# Altium schematic sheet Microcontroller.SchDoc: Стенд учебный
size 420 x 297 mm; ApprovedBy: Смирнов А.; CheckedBy: Михайлиди Д.; Author: Самарин И.; CompanyName: МЭИ; Address1: Address1; Address2: Address2; Address3: Address3; Address4: Address4; DocumentNumber: МЭИ.466219.001 Э3; SheetNumber: 1; SheetTotal: 5; Title2str: "Микропроцессорные устройства"; ProcessInspection: Заикин Д.; DocumentType: Схема электрическая принципиальная; FirstReferrence: АБВГ.123456.001
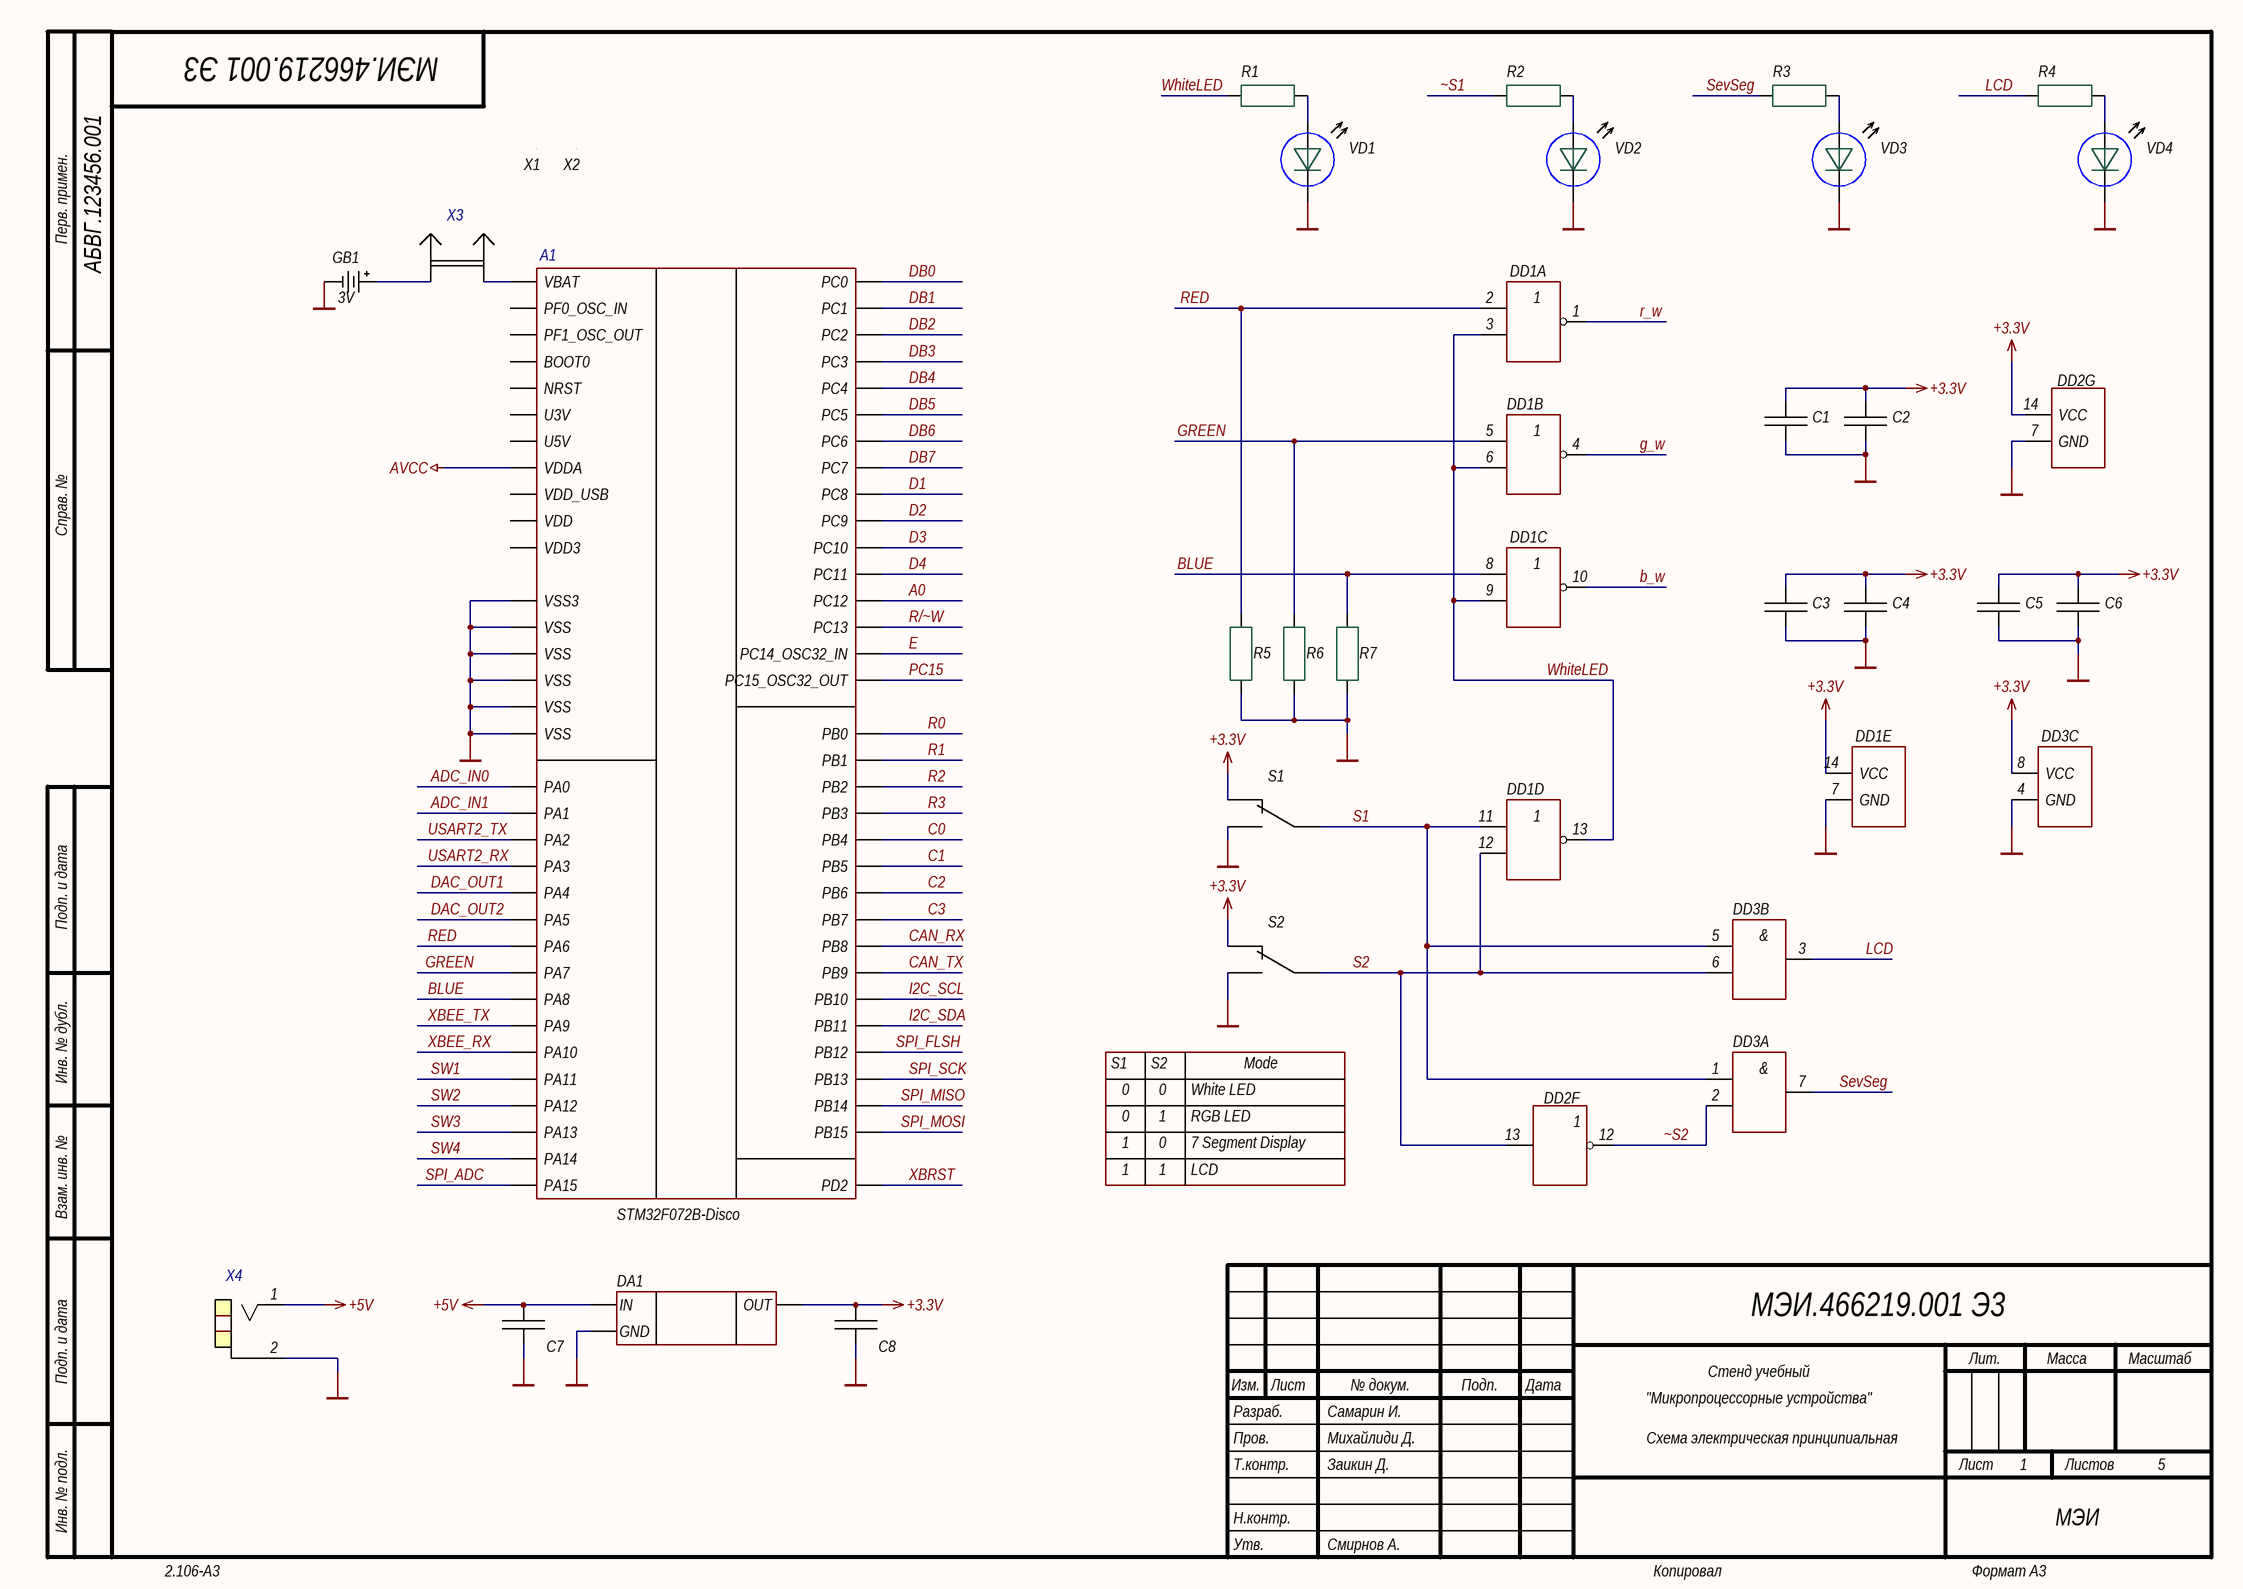
[diagram p0: Microcontroller.SchDoc]

## Parts
A1  STM32F072B-Disco  [STM32F072B-Disco]
C1  approved sub OK  [CAPC1608X90N]  (value not drawn)
C2  approved sub OK  [CAPC1608X90N]  (value not drawn)
C3  approved sub OK  [CAPC1608X90N]  (value not drawn)
C4  approved sub OK  [CAPC1608X90N]  (value not drawn)
C5  approved sub OK  [CAPC1608X90N]  (value not drawn)
C6  approved sub OK  [CAPC1608X90N]  (value not drawn)
C7  approved sub OK  [CAPC1608X90N]  (value not drawn)
C8  approved sub OK  [CAPC1608X90N]  (value not drawn)
DA1  ADP3339AKCZ-3.3-RL7  [SOT223]  (value not drawn)
DD1  74LV02D.112  [SOIC127P600X175-14AN]  (value not drawn)  (parts A,B,C,D,E of 5)
DD2  SN74AHCU04DR  [SOIC127P780X200-14N]  (value not drawn)  (parts F,G of 7)
DD3  74LVC2G08DP.125  [TSSOP65P400X110-8N]  (value not drawn)  (parts A,B,C of 3)
GB1  3V  [HU2032-1]
R1  Thick Film  [RESC1608X55N]  (value not drawn)
R2  Thick Film  [RESC1608X55N]  (value not drawn)
R3  Thick Film  [RESC1608X55N]  (value not drawn)
R4  Thick Film  [RESC1608X55N]  (value not drawn)
R5  Thick Film  [RESC1608X55N]  (value not drawn)
R6  Thick Film  [RESC1608X55N]  (value not drawn)
R7  Thick Film  [RESC1608X55N]  (value not drawn)
S1  ON-ON  [SWITCH_SPDT_SLIDER]  (value not drawn)
S2  ON-ON  [SWITCH_SPDT_SLIDER]  (value not drawn)
VD1  FYLS-0603URC  [LED-0603-GREEN]  (value not drawn)
VD2  FYLS-0603URC  [LED-0603-GREEN]  (value not drawn)
VD3  FYLS-0603URC  [LED-0603-GREEN]  (value not drawn)
VD4  FYLS-0603URC  [LED-0603-GREEN]  (value not drawn)
X1  PBS-40  [PBS33]  (value not drawn)
X2  PBS-40  [PBS33]  (value not drawn)
X3  PLS-2  [HDR_1x2]  (value not drawn)
X4  PJ-002A  [CONN_PWR_JACK_2.1x5.5mm]  (value not drawn)

## Nets
+3.3V: C1.1 C2.1 C3.1 C4.1 C5.1 C6.1 C8.1 DA1.2(OUT) DD1.14(VCC) DD2.14(VCC) DD3.8(VCC) S1.3 S2.3
+5V: C7.1 DA1.3(IN) X4.1(VCC)
AVCC: A1.P2_19(VDDA)
GND: A1.P1_2(VSS) A1.P1_9(VSS) A1.P1_19(VSS3) A1.P1_33(VSS) A1.P2_2(VSS) A1.P2_33(VSS) C1.2 C2.2 C3.2 C4.2 C5.2 C6.2 C7.2 C8.2 DA1.1(GND) DD1.7(GND) DD2.7(GND) DD3.4(GND) GB1.GND(MINUS) R5.1 R6.1 R7.1 S1.1 S2.1 VD1.K VD2.K VD3.K VD4.K X4.2(GND)
A0: A1.P2_13(PC12)
ADC_IN0: A1.P1_15(PA0)
ADC_IN1: A1.P1_16(PA1)
b_w: DD1.10(3Y)
BLUE: A1.P2_25(PA8) DD1.8(3A) R7.2
C0: A1.P2_10(PB4)
C1: A1.P2_9(PB5)
C2: A1.P2_8(PB6)
C3: A1.P2_7(PB7)
CAN_RX: A1.P2_4(PB8)
CAN_TX: A1.P2_3(PB9)
D1: A1.P2_27(PC8)
D2: A1.P2_26(PC9)
D3: A1.P2_15(PC10)
D4: A1.P2_14(PC11)
DAC_OUT1: A1.P1_21(PA4)
DAC_OUT2: A1.P1_22(PA5)
DB0: A1.P1_11(PC0)
DB1: A1.P1_12(PC1)
DB2: A1.P1_13(PC2)
DB3: A1.P1_14(PC3)
DB4: A1.P1_25(PC4)
DB5: A1.P1_26(PC5)
DB6: A1.P2_29(PC6)
DB7: A1.P2_28(PC7)
E: A1.P1_5(PC14_OSC32_IN)
g_w: DD1.4(2Y)
GREEN: A1.P1_24(PA7) DD1.5(2A) R6.2
I2C_SCL: A1.P1_30(PB10)
I2C_SDA: A1.P1_31(PB11)
LCD: DD3.3(2Y) R4.1
PC15: A1.P1_6(PC15_OSC32_OUT)
R0: A1.P1_27(PB0)
R1: A1.P1_28(PB1)
R2: A1.P1_29(PB2)
R3: A1.P2_11(PB3)
R/~W: A1.P1_4(PC13)
r_w: DD1.1(1Y)
RED: A1.P1_23(PA6) DD1.2(1A) R5.2
S1: DD1.11(4A) DD3.1(1A) DD3.5(2A) S1.2
S2: DD1.12(4B) DD2.13(6A) DD3.6(2B) S2.2
SevSeg: DD3.7(1Y) R3.1
SPI_ADC: A1.P2_16(PA15)
SPI_FLSH: A1.P1_32(PB12)
SPI_MISO: A1.P2_31(PB14)
SPI_MOSI: A1.P2_30(PB15)
SPI_SCK: A1.P2_32(PB13)
SW1: A1.P2_22(PA11)
SW2: A1.P2_21(PA12)
SW3: A1.P2_20(PA13)
SW4: A1.P2_17(PA14)
USART2_RX: A1.P1_18(PA3)
USART2_TX: A1.P1_17(PA2)
WhiteLED: DD1.3(1B) DD1.6(2A) DD1.9(3B) DD1.13(4Y) R1.1
XBEE_RX: A1.P2_23(PA10)
XBEE_TX: A1.P2_24(PA9)
XBRST: A1.P2_12(PD2)
~S1: R2.1
~S2: DD2.12(6Y) DD3.2(1B)
NetA1_P1_3: A1.P1_3(VBAT) X3.2
NetGB1_VCC: GB1.VCC(PLUS) X3.1
NetR1_2: R1.2 VD1.A(AR)
NetR2_2: R2.2 VD2.A(AR)
NetR3_2: R3.2 VD3.A(AR)
NetR4_2: R4.2 VD4.A(AR)

Not connected (* = marked no-connect by the designer): A1 P1_1(U3V) P1_7(PF0_OSC_IN) P1_8(PF1_OSC_OUT) P1_10(NRST) P1_20(VDD3) P2_1(U5V) P2_5(VDD) P2_6(BOOT0) P2_18(VDD_USB); X1 1(VCC); X2 1(VCC)

## Notes on the sheet
- S1
- S2
- Mode
- 0
- 1
- White LED
- RGB LED
- 7 Segment Display
- LCD
- Перв. примен.
- Справ. №
- Подп. и дата
- Инв. № дубл.
- Взам. инв. №
- Разраб.
- Изм.
- Лист
- № докум.
- Подп.
- Дата
- Лит.
- Масса
- Масштаб
- Пров.
- Т.контр.
- Листов
- Инв. № подл.
- Утв.
- Н.контр.
- 2.106-A3
- Копировал
- Формат А3
- (in symbol 74LVC2G08DP.125, part A) &
- (in symbol 74LVC2G08DP.125, part B) &

## Library data of the parts
A1 = STM32F072B-Disco: The STM32F072 discovery kit; Model: STM32F072B-Disco; ComponentLink1Description: Documentation; ComponentLink1URL: https://www.st.com/content/ccc/resource/technical/document/user_manual/3b/8d/46/57/b7/a9/49/b4/DM00099401.pdf/files/DM00099401.pdf/jcr:content/translations/en.DM00099401.pdf; ComponentLink2Description: KOMPEL; ComponentLink2URL: https://www.compel.ru/infosheet/ST/STM32F072B-DISCO
C1 C3 C5 = CAPC_100n_0603_X7R_50V_10%: Capacitor SMD Cer 100nF 10% 50V X7R 0603; Manufacturer 1: TDK Corporation; Manufacturer Part Number 1: C1608X7R1H104K; Ratings: 50V; X7R; Material: ceramic; SCDType: spec; Value: 100n; Package / Case: 0603 (1608 Metric); Tolerance: ±10%; Supplier 1: Compel; Supplier Part Number 1: *; ComponentLink1URL: https://www.compel.ru/infosheet/TDK/C1608X7R1H104KT; ComponentLink1Description: Compel; Supplier Part Number 2: *
C2 C4 C6 = CAPC_10u_0805_10V: Capacitor SMD Cer 10uF 10% 10V X5R 0603; Manufacturer 1: TDK Corporation; Manufacturer Part Number 1: C1608X5R1A106K080AC; Ratings: 10V; X5R; Material: ceramic; Value: 10µ; SCDType: spec; Package / Case: 0603 (1608 Metric); Tolerance: ±10%; Supplier Part Number 1: *; ComponentLink1URL: https://www.compel.ru/infosheet/TDK/C1608X5R1A106K080AC; ComponentLink1Description: Compel; Supplier 1: Compel
C7 C8 = CAPC_1u_0603_X7R_16V_10%: Capacitor SMD Cer 1uF 10% 16V X7R 0603; Manufacturer 1: TDK Corporation; Manufacturer Part Number 1: C1608X7R1A105K080AC; Ratings: 16V; X7R; Material: ceramic; SCDType: spec; Value: 1µ; Package / Case: 0603 (1608 metric); Tolerance: ±10%; Supplier 1: Compel; Supplier Part Number 1: 445-1604-1-ND; ComponentLink1URL: https://www.compel.ru/infosheet/TDK/C1608X7R1A105K080AC; ComponentLink1Description: Compel
DA1 = ADP3339AKCZ-3.3-RL7: StateVoltageSource; Manufacture: Analog Devices; HelpURL: https://www.compel.ru/infosheet/AD/ADP3339AKCZ-3.3-RL7; Case: SOT-223; Model: ADP3339AKCZ-3.3-RL7
DD1 = 74LV02D.112: 4x2ИЛИ-НЕ; Manufacture: NEXPERIA B.V.; HelpURL: https://www.compel.ru/infosheet/NEX-NXP/74LV02D.112; Case: SO14; Model: 74LV02D.112
DD2 = SN74AHCU04: HEX invertor; Manufacture: TI; HelpURL: https://www.compel.ru/infosheet/TI/SN74AHCU04D; Case: SO-14 (NS); Model: SN74AHCU04DR
DD3 = 74LVC2G08DP.125: 2x2И; Manufacture: NEXPERIA B.V.; HelpURL: https://www.compel.ru/infosheet/NEX-NXP/74LVC2G08DP.125; Case: TSSOP8; Model: 74LVC2G08DP.125
GB1 = Battery: Holder; Value: 3V; Model: HU2032-1; ComponentLink1Description: HolderDatasheet; ComponentLink1URL: https://www.compel.ru/item-pdf/9f8fe22c0277a17744fe21e4a6f50dee/pn/renata~bat-hold.hu2032-lf.pdf; ComponentLink2Description: KOMPEL; ComponentLink2URL: https://www.compel.ru/infosheet/RENATA/BAT%2FHOLD.HU2032-LF
R1-R4 = RES_68R_0603_5%: Resistor SMD chip 68 Ohm 0.1W 5% 0603; Manufacturer 1: Yageo; Manufacturer Part Number 1: RC0603FR-0768RL; Ratings: 1/10 W; Tolerance: ±1%; SCDType: spec; Value: 68R; ComponentLink1Designator: Compel; Package / Case: 0603 (1608 metric); Material: Thick Film; Supplier 1: Compel; Supplier Part Number 1: 311-68GRCT-ND; ComponentLink1URL: https://www.compel.ru/infosheet/YAG/RC0603FR-0768RL
R5-R7 = RES_10K_0603_1%: Resistor SMD chip 10k Ohm 0.1W 1% 0603; Manufacturer 1: Yageo; Manufacturer Part Number 1: RC0603FR-0710KL; Ratings: 1/10W; SCDType: spec; ComponentLink1Designator: Compel; Package / Case: 0603 (1608 Metric); Supplier 1: Compel; Supplier Part Number 1: 311-10.0KHRCT-ND; Tolerance: ±1%; Value: 10K; ComponentLink1URL: https://www.compel.ru/infosheet/YAG/RC0603FR-0710KL
S1 S2 = SW_THD_SPDT_On-On: Switch THD vertical toggle SPDT; Manufacturer 1: TE Connectivity; Manufacturer Part Number 1: SLS121PC04; Contact Rating @ Voltage: 0.25A @ 125VAC; SCDType: spec; ComponentLink1Designator: Compel; Circuit: SPDT; Mounting Type: PCB mount; Supplier 1: Compel; Supplier Part Number 1: 450-1598-ND; Switch Function: On-On; ComponentLink1URL: https://www.compel.ru/infosheet/TE/SLS121PC04
VD1-VD4 = FYLS-0603URC: LED; Manufacture: FORYARD OPTOELECTRONICS CO.,LTD; ComponentLink1Descriptor: Terraelectronica; Model: FYLS-0603URC; Case: L_0603/SMD; ComponentLink1URL: https://www.terraelectronica.ru/product/339750
X1 X2 = CONN Disco: Manufacture: CONNFLY; ComponentLink1Designator: Compel; ComponentLink1URL: https://www.compel.ru/infosheet/CONNFLY/PBS-40; Model: PBS-40
X3 = PLS-2 _1: Jumper; Manufacture: NINGBO KLS Electronic Co.,Ltd.; Model: PLS-2; HelpURL: https://www.compel.ru/infosheet/KLS/PLS-2
X4 = EJ503A (K375A): Power connector; Manufacture: MEMORY PROTECTION Devices Inc.; Model: PJ-002A; HelpURL: https://www.terraelectronica.ru/product/1370664; Case: 5.5*2.1mm